# EAGLE design Aquarius (EAGLE 6.4)
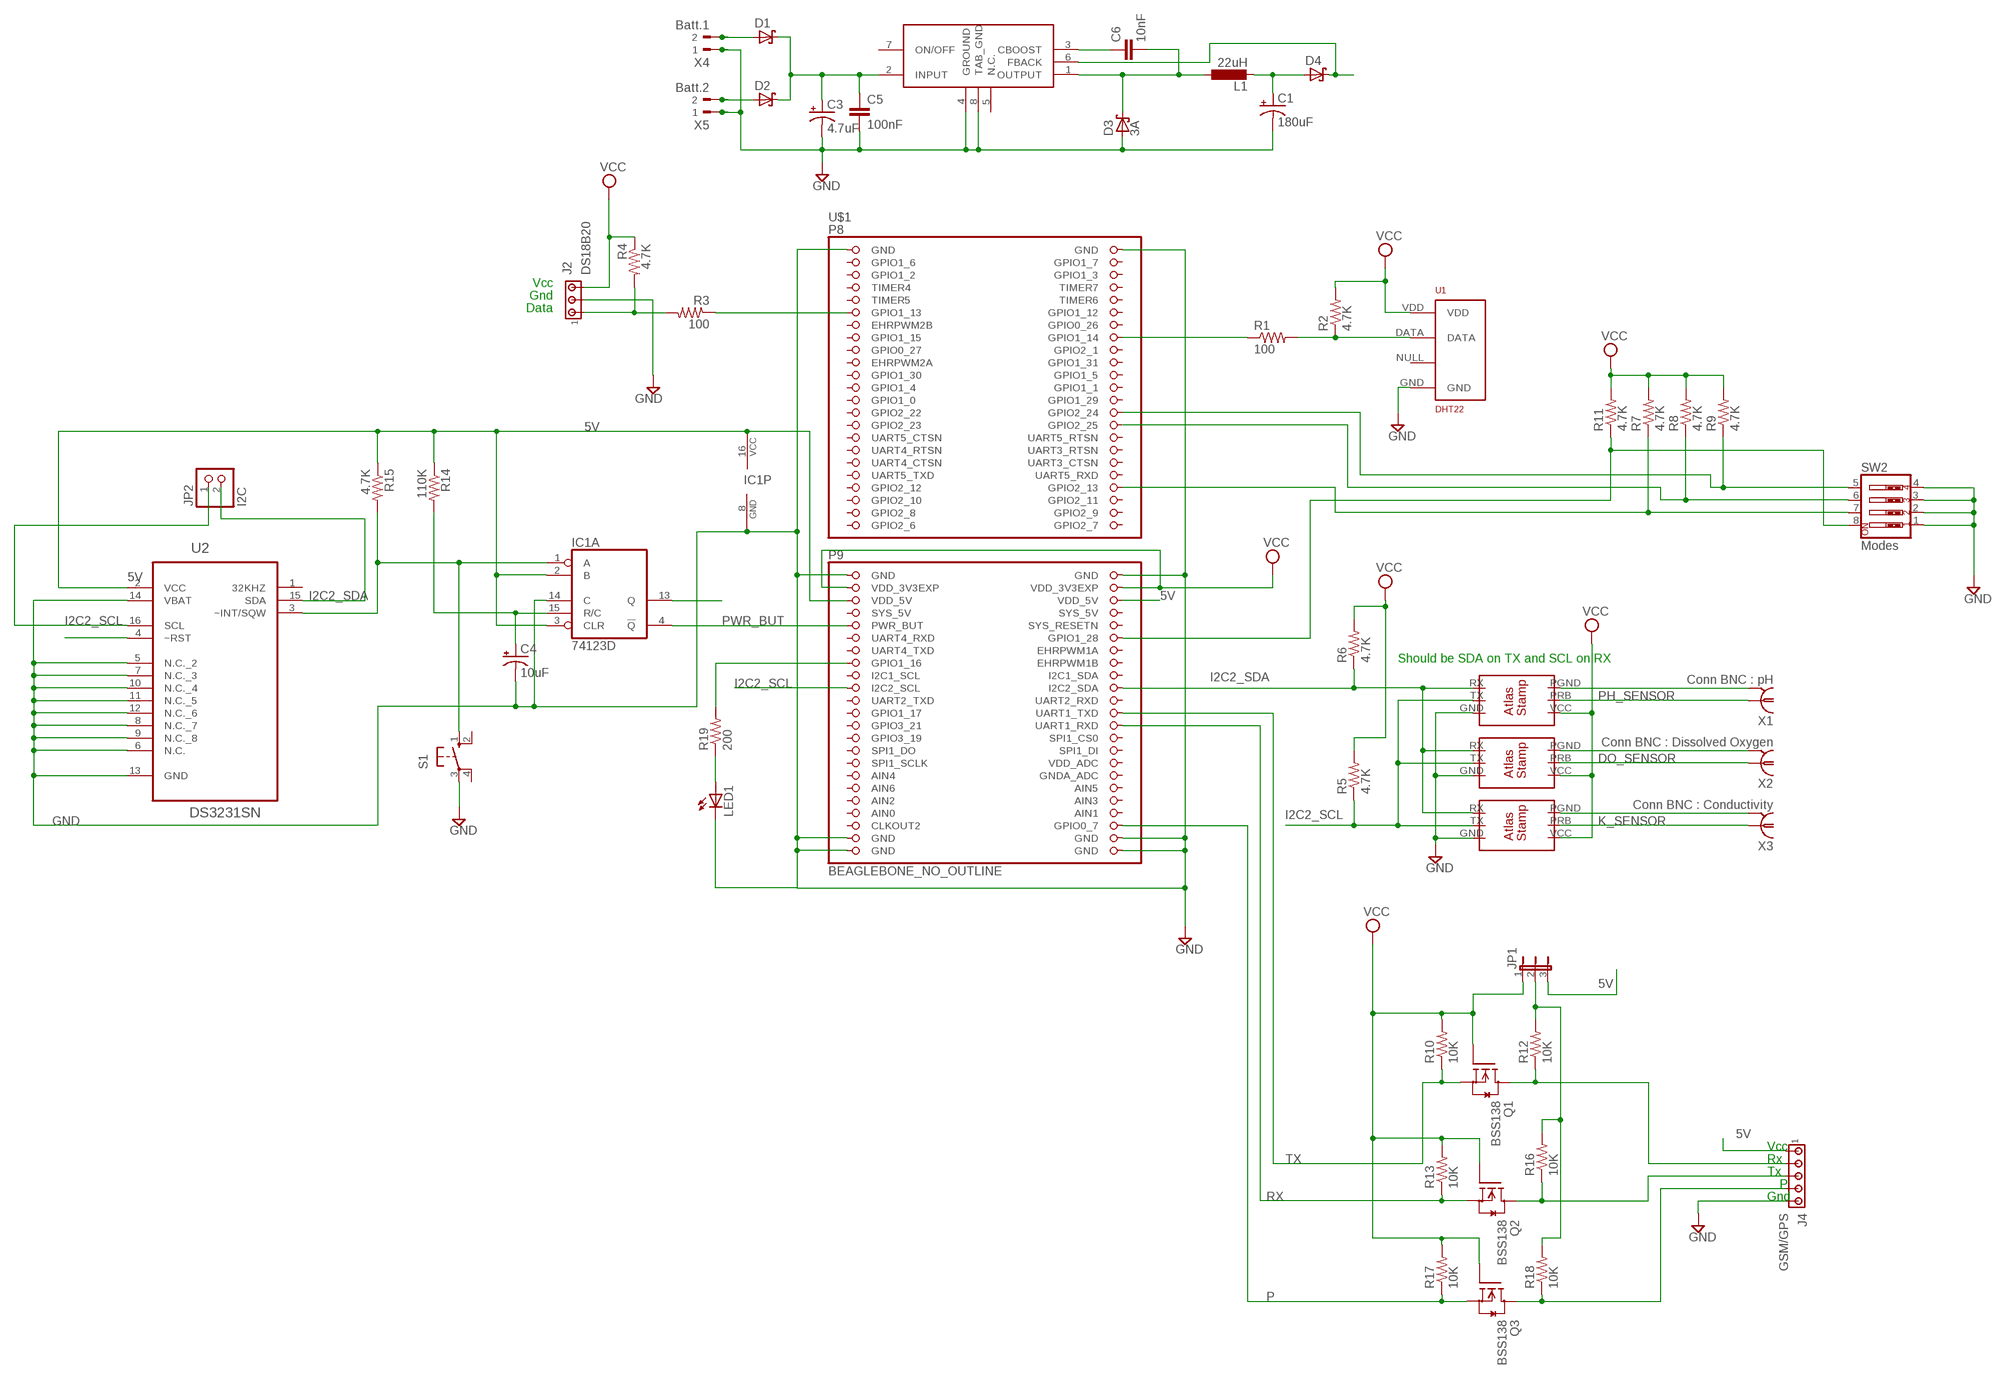
[diagram p0: schematic, sheet 1]

## Parts
C1  180uF  CPOL-USD  [PANASONIC_D]
C3  4.7uF  CPOL-USB  [PANASONIC_B]
C4  10uF  CPOL-USB  [PANASONIC_B]
C5  100nF  C-EUC0805  [C0805]
C6  10nF  C-EUC0805  [C0805]
D1  SCHOTTKY-DIODEDO201T15  [DO201T15]
D2  SCHOTTKY-DIODEDO201T15  [DO201T15]
D3  3A  SCHOTTKY-DIODEDO201T15  [DO201T15]
D4  SCHOTTKY-DIODEDO201T15  [DO201T15]
IC1  74123D  [SO16]
J2  DS18B20  MTA03-100  [10X03MTA]
J4  GSM/GPS  MTA05-100  [10X05MTA]
JP1  JP2E  [JP2]
JP2  I2C  PINHD-1X2  [1X02]
L1  22uH  L-EU10X10-EPCOS  [EPCOS-10X10]
LED1  LEDCHIP-LED0805  [CHIP-LED0805]
LM2678  LM2678KTW0007B  [TO-PMOD7]
Q1  BSS138  [SOT23]
Q2  BSS138  [SOT23]
Q3  BSS138  [SOT23]
R1  100  R-US_R0805  [R0805]
R2  4.7K  R-US_R0805  [R0805]
R3  100  R-US_R0805  [R0805]
R4  4.7K  R-US_R0805  [R0805]
R5  4.7K  R-US_R0805  [R0805]
R6  4.7K  R-US_R0805  [R0805]
R7  4.7K  R-US_R0805  [R0805]
R8  4.7K  R-US_R0805  [R0805]
R9  4.7K  R-US_R0805  [R0805]
R10  10K  R-US_R0805  [R0805]
R11  4.7K  R-US_R0805  [R0805]
R12  10K  R-US_R0805  [R0805]
R13  10K  R-US_R0805  [R0805]
R14  110K  R-US_R0805  [R0805]
R15  4.7K  R-US_R0805  [R0805]
R16  10K  R-US_R0805  [R0805]
R17  10K  R-US_R0805  [R0805]
R18  10K  R-US_R0805  [R0805]
R19  200  R-US_R0805  [R0805]
S1  10-XX  [B3F-10XX]
SW2  Modes  SW_DIP-4  [EDG-04]
U1  DHT22  RHT03_DHT-22_AM2302WIRED  [AM2302]
U2  DS3231SN  [SOIC127P1032X265-16N]
U$1  BEAGLEBONE_NO_OUTLINE  [BEAGLEBONE_SHIELD_NO_OUTLINE]
U$2  ATLAS_STAMP  [ATLAS_STAMP]
U$3  ATLAS_STAMP  [ATLAS_STAMP]
U$4  ATLAS_STAMP  [ATLAS_STAMP]
X1  Conn BNC : pH  1-227161-0  [AMP_227161]
X2  Conn BNC : Dissolved Oxygen  1-227161-0  [AMP_227161]
X3  Conn BNC : Conductivity  1-227161-0  [AMP_227161]
X4  Batt.1  180G-2  [180G-2]
X5  Batt.2  180G-2  [180G-2]

## Nets
5V: D4.C IC1.2(A:B) IC1.3(A:CLR) IC1.16(P:VCC) J4.1 JP1.3 LM2678.6(FBACK) R14.1 R15.1 U2.2(VCC) U$1.51(VDD_5V) U$1.52(VDD_5V)
DO_SENSOR: U$3.PRB X2.1
GND: C1.- C3.- C4.- C5.2 D3.A IC1.8(P:GND) IC1.14(A:C) J2.2 J4.5 LED1.C LM2678.4(GROUND) LM2678.8(TAB_GND) S1.3(P) SW2.1 SW2.2 SW2.3 SW2.4 U1.GND U2.5(N.C._2) U2.6(N.C.) U2.7(N.C._3) U2.8(N.C._7) U2.9(N.C._8) U2.10(N.C._4) U2.11(N.C._5) U2.12(N.C._6) U2.13(GND) U2.14(VBAT) U$1.1(GND) U$1.2(GND) U$1.47(GND) U$1.48(GND) U$1.89(GND) U$1.90(GND) U$1.91(GND) U$1.92(GND) U$2.GND U$3.GND U$4.GND X4.1 X5.1
I2C2_SCL: JP2.1 R5.1 U2.16(SCL) U$1.65(I2C2_SCL) U$2.TX U$3.TX U$4.TX
I2C2_SDA: JP2.2 R6.1 U2.15(SDA) U$1.66(I2C2_SDA) U$2.RX U$3.RX U$4.RX
INT: IC1.1(A:A) R15.2 S1.1(S) U2.3(~INT/SQW)
K_SENSOR: U$4.PRB X3.1
N$1: J4.4 Q3.3(D) R18.1
N$2: D1.A X4.2
N$3: R1.2 R2.1 U1.DATA
N$4: R3.1 U$1.11(GPIO1_13)
N$5: J2.1 R3.2 R4.2
N$6: R1.1 U$1.16(GPIO1_14)
N$7: R7.1 SW2.7 U$1.40(GPIO2_13)
N$8: D2.A X5.2
N$9: C6.1 LM2678.3(CBOOST)
N$10: C3.+ C5.1 D1.C D2.C LM2678.2(INPUT)
N$11: U$2.PGND X1.2
N$12: U2.4(~RST)
N$13: C6.2 D3.C L1.P$1 LM2678.1(OUTPUT)
N$14: U$4.PGND X3.2
N$15: U$3.PGND X2.2
N$16: C1.+ D4.A L1.P$2
N$17: C4.+ IC1.15(A:R/C) R14.2
N$18: R11.1 SW2.8 U$1.58(GPIO1_28)
N$19: R8.1 SW2.6 U$1.30(GPIO2_25)
N$20: IC1.13(A:Q)
N$21: R9.1 SW2.5 U$1.28(GPIO2_24)
N$22: J4.3 Q2.3(D) R16.1
N$23: J4.2 Q1.3(D) R12.1
N$25: JP1.2 R12.2 R16.2 R18.2
N$26: LED1.A R19.1
N$27: R19.2 U$1.61(GPIO1_16)
P: Q3.2(S) R17.1 U$1.88(GPIO0_7)
PH_SENSOR: U$2.PRB X1.1
PWR_BUT: IC1.4(A:!Q) U$1.55(PWR_BUT)
RX: Q2.2(S) R13.1 U$1.72(UART1_RXD)
TX: Q1.2(S) R10.1 U$1.70(UART1_TXD)
VCC: J2.3 JP1.1 Q1.1(G) Q2.1(G) Q3.1(G) R2.2 R4.1 R5.2 R6.2 R7.2 R8.2 R9.2 R10.2 R11.2 R13.2 R17.2 U1.VDD U$1.49(VDD_3V3EXP) U$1.50(VDD_3V3EXP) U$2.VCC U$3.VCC U$4.VCC
Unconnected: IC1.5(B:Q) IC1.6(B:C) IC1.7(B:R/C) IC1.9(B:A) IC1.10(B:B) IC1.11(B:CLR) IC1.12(B:!Q) LM2678.5(N.C.) LM2678.7(ON/OFF) S1.2(S1) S1.4(P1) U1.NULL U2.1(32KHZ) U$1.3(GPIO1_6) U$1.4(GPIO1_7) U$1.5(GPIO1_2) U$1.6(GPIO1_3) U$1.7(TIMER4) U$1.8(TIMER7) U$1.9(TIMER5) U$1.10(TIMER6) U$1.12(GPIO1_12) U$1.13(EHRPWM2B) U$1.14(GPIO0_26) U$1.15(GPIO1_15) U$1.17(GPIO0_27) U$1.18(GPIO2_1) U$1.19(EHRPWM2A) U$1.20(GPIO1_31) U$1.21(GPIO1_30) U$1.22(GPIO1_5) U$1.23(GPIO1_4) U$1.24(GPIO1_1) U$1.25(GPIO1_0) U$1.26(GPIO1_29) U$1.27(GPIO2_22) U$1.29(GPIO2_23) U$1.31(UART5_CTSN) U$1.32(UART5_RTSN) U$1.33(UART4_RTSN) U$1.34(UART3_RTSN) U$1.35(UART4_CTSN) U$1.36(UART3_CTSN) U$1.37(UART5_TXD) U$1.38(UART5_RXD) U$1.39(GPIO2_12) U$1.41(GPIO2_10) U$1.42(GPIO2_11) U$1.43(GPIO2_8) U$1.44(GPIO2_9) U$1.45(GPIO2_6) U$1.46(GPIO2_7) U$1.54(SYS_5V) U$1.56(SYS_RESETN) U$1.57(UART4_RXD) U$1.59(UART4_TXD) U$1.60(EHRPWM1A) U$1.62(EHRPWM1B) U$1.63(I2C1_SCL) U$1.64(I2C1_SDA) U$1.67(UART2_TXD) U$1.68(UART2_RXD) U$1.69(GPIO1_17) U$1.71(GPIO3_21) U$1.73(GPIO3_19) U$1.74(SPI1_CS0) U$1.75(SPI1_DO) U$1.76(SPI1_DI) U$1.77(SPI1_SCLK) U$1.78(VDD_ADC) U$1.79(AIN4) U$1.80(GNDA_ADC) U$1.81(AIN6) U$1.82(AIN5) U$1.83(AIN2) U$1.84(AIN3) U$1.86(AIN1) U$1.87(CLKOUT2)

## Notes on the sheet
- Vcc
- Gnd
- Data
- Should be SDA on TX and SCL on RX
- Vcc
- Rx
- Tx
- P
- Gnd

## Power pins joined to a net without a drawn wire
AIN0: U$1.85(AIN0)
SYS_5V: U$1.53(SYS_5V)

## Library data of the parts
C1 C3 C4 = rcl:CPOL-US: POLARIZED CAPACITOR, American symbol
C5 C6 = rcl:C-EU: CAPACITOR, European symbol
D1-D4 = diode:SCHOTTKY-DIODE: Schottky Diode
IC1 = 74xx-us:74*123: Retriggerable monostable MULTIVIBRATOR
J2 = con-amp:MTA03-100: AMP connector
J4 = con-amp:MTA05-100: AMP connector
JP1 = jumper:JP2E: JUMPER
JP2 = pinhead:PINHD-1X2: PIN HEADER
L1 = jt-inductors:L-EU: Inductor
LED1 = led:LED: LED OSRAM: - CHIPLED LG R971, LG N971, LY N971, LG Q971, LY Q971, LO R971, LY R971 LH N974, LH R974 LS Q976, LO Q976, LY Q976 LO Q996 - Hyper CHIPLED LW Q18S LB Q993, LB Q99A, LB R99A - SideLED LS A670, LO A670, LY A670, LG A670, LP A670 LB A673, LV A673, LT A673, LW A673 LH A674 LY A675 LS A676, LA A676, LO A676, LY A676, LW A676 LS A679, LY A679, LG A679 - Hyper Micro SIDELED® LS Y876, LA Y876, LO Y876, LY Y876 LT Y87S - SmartLED LW L88C, LW L88S LB L89C, LB L89S, LG L890 LS L89K, LO L89K, LY L89K LS L896, LA L896, LO L896, LY L896 - TOPLED LS T670, LO T670, LY T670, LG T670, LP T670 LSG T670, LSP T670, LSY T670, LOP T670, LYG T670 LG T671, LOG T671, LSG T671 LB T673, LV T673, LT T673, LW T673 LH T674 LS T676, LA T676, LO T676, LY T676, LB T676, LH T676, LSB T676, LW T676 LB T67C, LV T67C, LT T67C, LS T67K, LO T67K, LY T67K, LW E67C LS E67B, LA E67B, LO E67B, LY E67B, LB E67C, LV E67C, LT E67C LW T67C LS T679, LY T679, LG T679 LS T770, LO T770, LY T770, LG T770, LP T770 LB T773, LV T773, LT T773, LW T773 LH T774 LS E675, LA E675, LY E675, LS T675 LS T776, LA T776, LO T776, LY T776, LB T776 LHGB T686 LT T68C, LB T68C - Hyper Mini TOPLED® LB M676 - Mini TOPLED Santana® LG M470 LS M47K, LO M47K, LY M47K Source: http://www.osram.convergy.de LUXEON: - LUMILED® LXK2-PW12-R00, LXK2-PW12-S00, LXK2-PW14-U00, LXK2-PW14-V00 LXK2-PM12-R00, LXK2-PM12-S00, LXK2-PM14-U00 LXK2-PE12-Q00, LXK2-PE12-R00, LXK2-PE12-S00, LXK2-PE14-T00, LXK2-PE14-U00 LXK2-PB12-K00, LXK2-PB12-L00, LXK2-PB12-M00, LXK2-PB14-N00, LXK2-PB14-P00, LXK2-PB14-Q00 LXK2-PR12-L00, LXK2-PR12-M00, LXK2-PR14-Q00, LXK2-PR14-R00 LXK2-PD12-Q00, LXK2-PD12-R00, LXK2-PD12-S00 LXK2-PH12-R00, LXK2-PH12-S00 LXK2-PL12-P00, LXK2-PL12-Q00, LXK2-PL12-R00 Source: www.luxeon.com KINGBRIGHT: KA-3528ASYC Source: www.kingbright.com
LM2678 = Aquarius:LM2678: LM2678 SIMPLE SWITCHER® High Efficiency 5A Step-Down Voltage Regulator
Q1-Q3 = m-pad-2.1:BSS138: Fairchild Semiconductors BSS138 N-Channel Logic Level Enhancement Mode Field Effect Transistor General Description: These N-Channel enhancement mode field effect transistors are produced using Fairchild's proprietary, high cell density, DMOS technology. These products have been designed to minimize on-state resistance while provide rugged, reliable, and fast switching performance.These products are particularly suited for low voltage, low current applications such as small servo motor control, power MOSFET gate drivers, and other switching applications. Features: 0.22 A, 50 V. RDS(ON) = 3.5Ohm @ VGS = 10 V RDS(ON) = 6.0Ohm @ VGS = 4.5 V High density cell design for extremely low RDS(ON) Rugged and Reliable Compact industry standard SOT-23 surface mount package Please send any comments to: messi@users.sourceforge.net
R1-R19 = adafruit:R-US_: RESISTOR, American symbol
S1 = switch-omron:10-XX: OMRON SWITCH; MPN: B3F-1000; OC_FARNELL: 176432; OC_NEWARK: 36M3542
SW2 = special:SW_DIP-4: DIP SWITCH
U1 = RHT03_DHT-22_AM2302:RHT03_DHT-22_AM2302: RHT03 / DHT-22 / AM2302 Packages and symbol for the RHT03 / DHT-22 relative humidity and temperature sensor. Note: The AM2302 is a wired version of the DHT-22 which typically requires less clearance and is thus provided as a separate package.; PROD_ID: SEN-10167
U2 = Maxim_By_element14_Batch_1:DS3231SN: Extremely Accurate I2C-Integrated RTC/TCXO/Crystal; MPN: DS3231SN#; OC_FARNELL: 1593292; OC_NEWARK: 68K3406; PACKAGE: SOIC-16; SUPPLIER: Maxim
U$1 = LEDscape:BEAGLEBONE_NO_OUTLINE: Should match A3 pinout - but not completely tested
U$2-U$4 = LEDscape:ATLAS_STAMP
X1-X3 = con-coax:?227161*: JACK, RIGHT ANGLE, 50 OHM, PCB, BNC Source: amp_227161.pdf; MF: TYCO ELECTRONICS; MPN: 1-227161; OC_FARNELL: unknown; OC_NEWARK: 33B3200
X4 X5 = con-weidmueller-sl35:180G-2: WEIDMUELLER CLAMP CONNECTOR; OC_FARNELL: unknown; OC_NEWARK: unknown

## Board
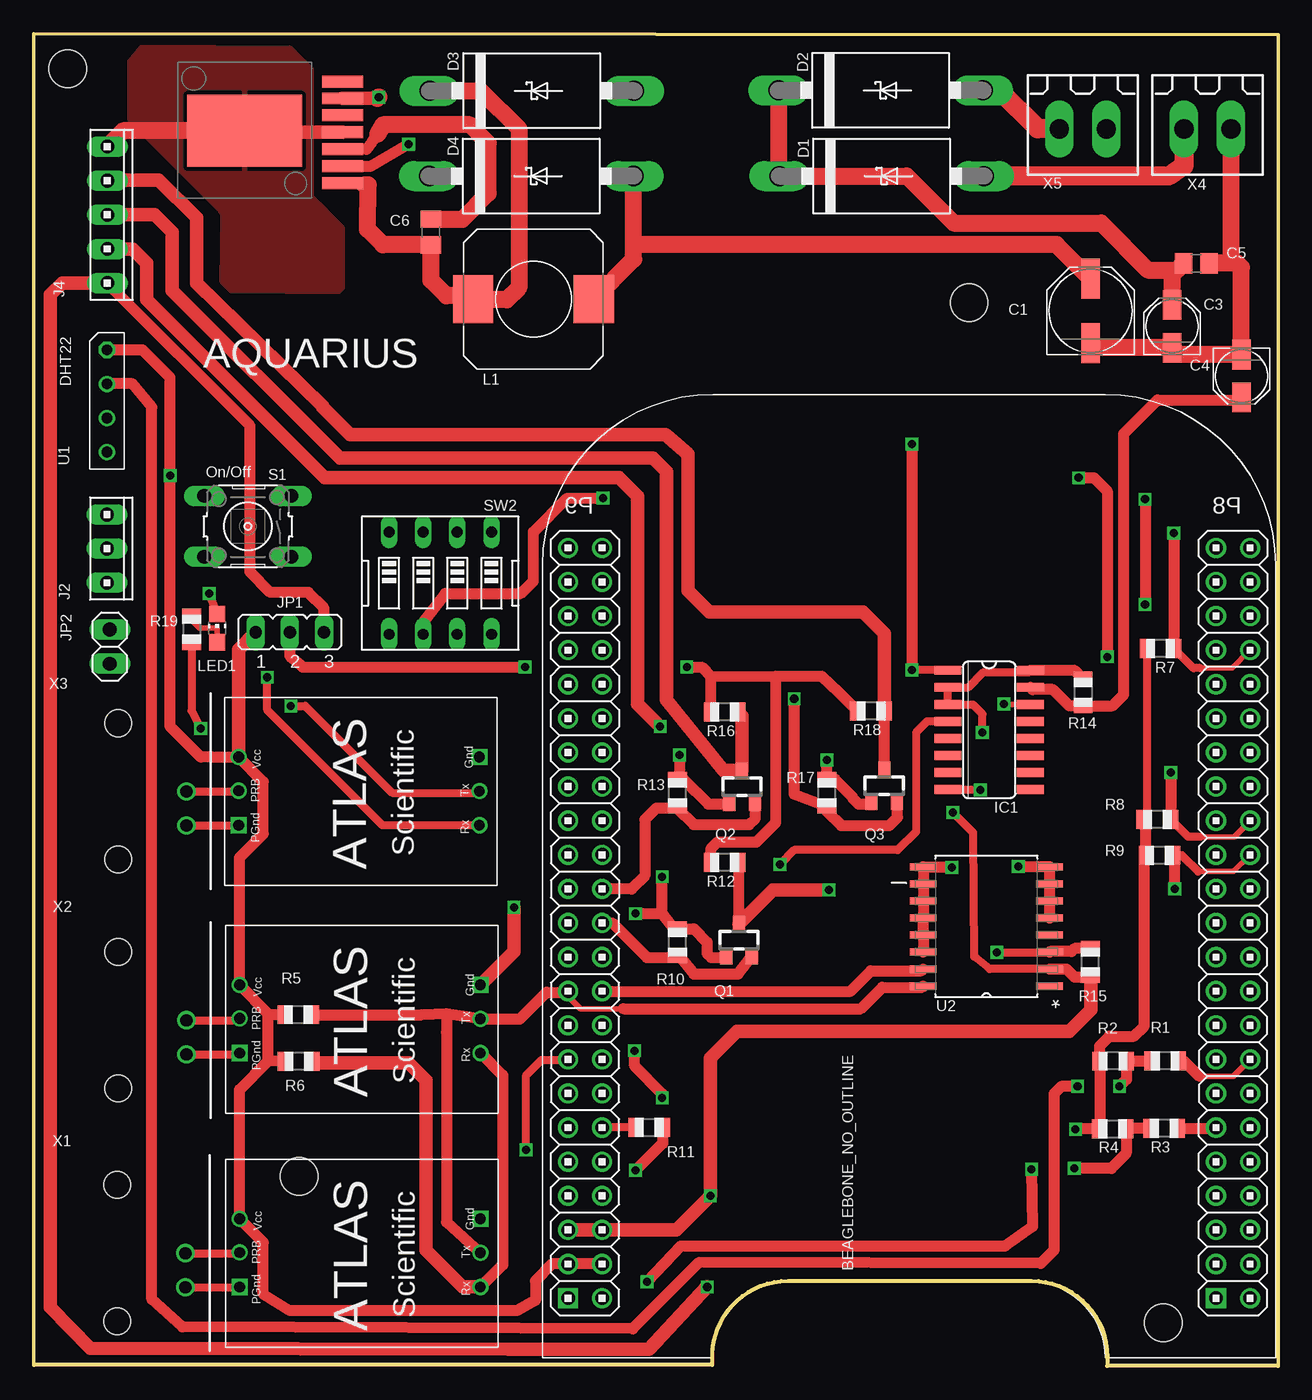
[diagram p1: board, top side]
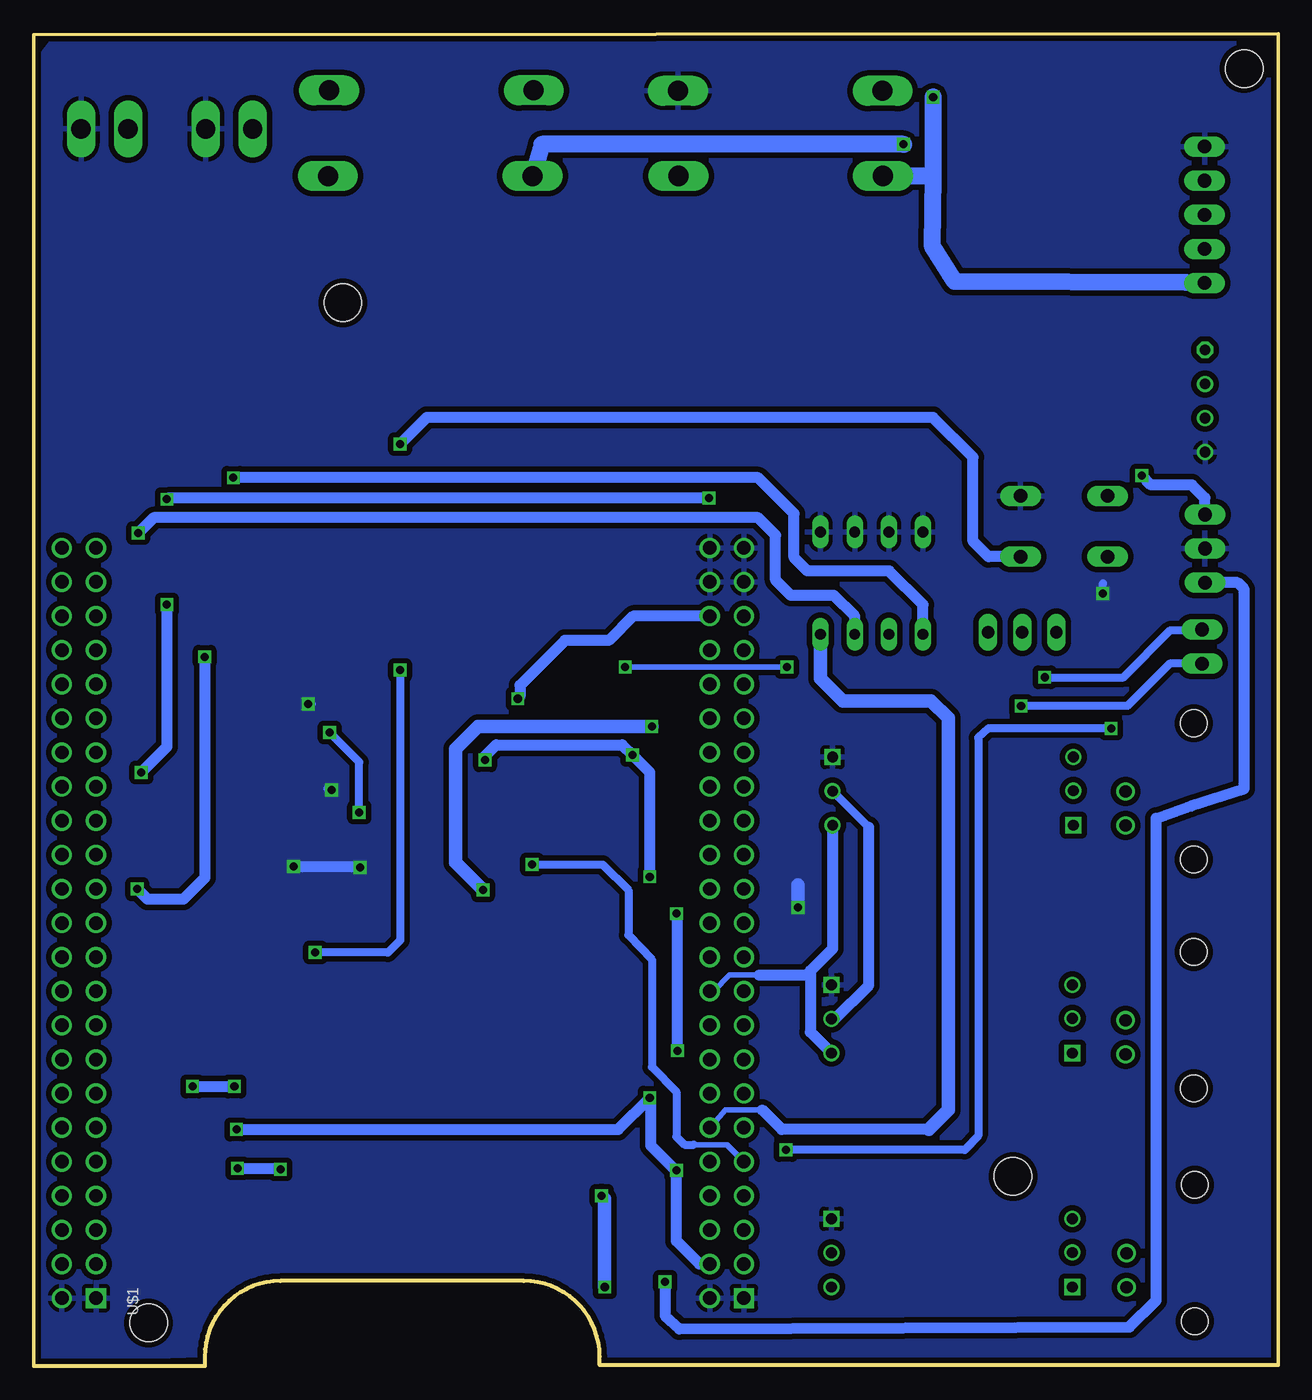
[diagram p2: board, bottom side, seen from below]

Size 92.72 x 99.24 mm. Coordinates in mm from the lower left corner, seen from the top.
Outline: 92.72,0 92.72,99.16 0,99.24 0,0.08
Outline: 92.7,0.01 79.97,0.01 79.97,0.7 arc90 74.33,6.33 56.2,6.33 arc90 50.56,0.7 50.56,0.09 0.04,0.09
Copper layers (1*16): Top 0.0356mm / dielectric 1.5011mm / Bottom 0.0356mm
Design rules "LaenPCBOrder *": minimum track width 6mil, minimum drill 13mil, track to track 10mil, track to pad 6mil, pad to pad 6mil, via to via 6mil, smd to smd 6mil, copper to edge 15mil, drill to drill 6mil, minimum pad ring 7mil, minimum via ring 7mil, stop-mask expansion 3mil, vias tented up to drill 0mil, thermal gap 12mil
Holes 2.8 mm at 84.16,3.21 69.68,79.18 2.55,96.63 19.77,14.11

### Footprints (pad centres in the part's own frame; a part is rotated, then mirrored left to right if it is on the bottom)
PANASONIC_D = smd 3 x 1.4: + 2.4,0; - -2.4,0
PANASONIC_B = smd 2.2 x 1.4: + 1.6,0; - -1.6,0
C0805 = smd 1.3 x 1.5: 1 -0.95,0; 2 0.95,0
DO201T15 = drill 1.499 long: A 7.62,0; C -7.62,0
SO16 = smd 0.66 x 2.032: 1 -4.445,-3.073; 2 -3.175,-3.073; 3 -1.905,-3.073; 4 -0.635,-3.073; 5 0.635,-3.073; 6 1.905,-3.073; 7 3.175,-3.073; 8 4.445,-3.073; 9 4.445,3.073; 10 3.175,3.073; 11 1.905,3.073; 12 0.635,3.073; 13 -0.635,3.073; 14 -1.905,3.073; 15 -3.175,3.073; 16 -4.445,3.073
10X03MTA = drill 1.016 long: 1 2.54,0; 2 0,0; 3 -2.54,0
10X05MTA = drill 1.016 long: 1 5.08,0; 2 2.54,0; 3 0,0; 4 -2.54,0; 5 -5.08,0
JP2 = drill 0.914 long: 1 -2.54,0; 2 0,0; 3 2.54,0
1X02 = drill 1.016 long: 1 -1.27,0; 2 1.27,0
EPCOS-10X10 = smd 3 x 3.6: P$1 -4.5,0; P$2 4.5,0
CHIP-LED0805 = smd 1.2 x 1.2: A 0,-1.05; C 0,1.05
TO-PMOD7 = smd 0.89 x 3.06: 1 -3.88,-7.3; 2 -2.62,-7.3; 3 -1.36,-7.3; 4 -0.1,-7.3; 5 1.16,-7.3; 6 2.42,-7.3; 7 3.68,-7.3 | smd 5.35 x 8.54: 8 0.01,0
SOT23 = smd 0.9 x 1.2: 1 -0.95,-1.2; 2 0.95,-1.2; 3 0,1.2
R0805 = smd 1.1 x 1.4: 1 -1,0; 2 1,0
B3F-10XX = drill 1.016 long: 1 -3.251,2.261; 2 3.251,2.261; 3 -3.251,-2.261; 4 3.251,-2.261
EDG-04 = drill 0.813 long: 1 -3.81,-3.81; 2 -1.27,-3.81; 3 1.27,-3.81; 4 3.81,-3.81; 5 3.81,3.81; 6 1.27,3.81; 7 -1.27,3.81; 8 -3.81,3.81
AM2302 = drill 0.8: DATA -1.27,0; GND 3.81,0; NULL 1.27,0 | drill 0.8 octagon: VDD -3.81,0
SOIC127P1032X265-16N = smd 1.981 x 0.533: 1 -4.699,4.445; 2 -4.699,3.175; 3 -4.699,1.905; 4 -4.699,0.635; 5 -4.699,-0.635; 6 -4.699,-1.905; 7 -4.699,-3.175; 8 -4.699,-4.445; 9 4.699,-4.445; 10 4.699,-3.175; 11 4.699,-1.905; 12 4.699,-0.635; 13 4.699,0.635; 14 4.699,1.905; 15 4.699,3.175; 16 4.699,4.445
BEAGLEBONE_SHIELD_NO_OUTLINE = drill 1 square: 1 4.445,19.05; 47 52.705,19.05 | drill 1: 2 1.905,19.05; 3 4.445,21.59; 4 1.905,21.59; 5 4.445,24.13; 6 1.905,24.13; 7 4.445,26.67; 8 1.905,26.67; 9 4.445,29.21; 10 1.905,29.21; 11 4.445,31.75; 12 1.905,31.75; 13 4.445,34.29; 14 1.905,34.29; 15 4.445,36.83; 16 1.905,36.83; 17 4.445,39.37; 18 1.905,39.37; 19 4.445,41.91; 20 1.905,41.91; 21 4.445,44.45; 22 1.905,44.45; 23 4.445,46.99; 24 1.905,46.99; 25 4.445,49.53; 26 1.905,49.53; 27 4.445,52.07; 28 1.905,52.07; 29 4.445,54.61; 30 1.905,54.61; 31 4.445,57.15; 32 1.905,57.15; 33 4.445,59.69; 34 1.905,59.69; 35 4.445,62.23; 36 1.905,62.23; 37 4.445,64.77; 38 1.905,64.77; 39 4.445,67.31; 40 1.905,67.31; 41 4.445,69.85; 42 1.905,69.85; 43 4.445,72.39; 44 1.905,72.39; 45 4.445,74.93; 46 1.905,74.93; 48 50.165,19.05; 49 52.705,21.59; 50 50.165,21.59; 51 52.705,24.13; 52 50.165,24.13; 53 52.705,26.67; 54 50.165,26.67; 55 52.705,29.21; 56 50.165,29.21; 57 52.705,31.75; 58 50.165,31.75; 59 52.705,34.29; 60 50.165,34.29; 61 52.705,36.83; 62 50.165,36.83; 63 52.705,39.37; 64 50.165,39.37; 65 52.705,41.91; 66 50.165,41.91; 67 52.705,44.45; 68 50.165,44.45; 69 52.705,46.99; 70 50.165,46.99; 71 52.705,49.53; 72 50.165,49.53; 73 52.705,52.07; 74 50.165,52.07; 75 52.705,54.61; 76 50.165,54.61; 77 52.705,57.15; 78 50.165,57.15; 79 52.705,59.69; 80 50.165,59.69; 81 52.705,62.23; 82 50.165,62.23; 83 52.705,64.77; 84 50.165,64.77; 85 52.705,67.31; 86 50.165,67.31; 87 52.705,69.85; 88 50.165,69.85; 89 52.705,72.39; 90 50.165,72.39; 91 52.705,74.93; 92 50.165,74.93
ATLAS_STAMP = drill 0.8 square: GND 4.445,18.97; PGND 9.525,1.03 | drill 0.8: PRB 6.95,1.03; RX 9.525,18.97; TX 6.985,18.97; VCC 4.445,1.03
AMP_227161 = drill 0.9 pad 1.27: 1 0,-5.08; 2 -2.54,-5.08 | hole 2: -5.08,0; 5.08,0
180G-2 = drill 1.422 long: 1 -1.75,0; 2 1.75,0

### Placement (x,y rotation side)
C1  78.73,78.59 90 top
C3  84.81,77.44 90 top
C4  89.97,73.73 270 top
C5  86.59,82.12 0 top
C6  29.59,84.46 270 top
D1  63.17,88.63 0 top
D2  63.09,95.01 0 top
D3  37.11,94.98 0 top
D4  37.07,88.63 0 top
DRILEGEND  [DRILEGEND]  -22.35,-18.83 0 top  (outside the outline)
IC1  71.17,47.37 270 top
J2  5.47,60.88 270 top
J4  5.49,85.74 270 top
JP1  19.09,54.65 0 top
JP2  5.68,53.58 90 top
L1  37.23,79.46 0 top
LED1  13.68,54.95 0 top
LM2678  15.72,91.99 90 top
Q1  52.54,31.71 0 top
Q2  52.77,43.14 0 top
Q3  63.36,43.22 0 top
R1  84.29,22.72 180 top
R2  80.4,22.71 180 top
R3  84.21,17.7 180 top
R4  80.38,17.67 0 top
R5  19.72,26.16 180 top
R6  19.74,22.69 180 top
R7  83.93,53.43 180 top
R8  83.71,40.7 180 top
R9  83.86,38.03 180 top
R10  47.97,31.56 90 top
R11  45.86,17.78 0 top
R12  51.47,37.5 180 top
R13  47.97,42.68 90 top
R14  78.17,50.17 270 top
R15  78.72,30.09 90 top
R16  51.47,48.7 180 top
R17  59.09,42.68 90 top
R18  62.37,48.78 180 top
R19  11.77,54.87 270 top
S1  15.96,62.54 180 top
SW2  30.29,58.3 180 top
U1  5.46,71.87 270 top
U2  70.97,32.73 180 top
U$1  92.52,-14 0 bottom
U$2  14.31,15.4 270 top
U$3  14.31,32.83 270 top
U$4  14.24,49.8 270 top
X1  6.23,8.4 90 top
X2  6.3,25.75 90 top
X3  6.3,42.8 90 top
X4  87.44,92.14 180 top
X5  78.14,92.14 180 top

### Tracks (layer width: path | path; a pad name or v marks a point on that pad's centre or on a via)
5V  (via drill 0.6)
  Top 0.61: v68.47,41.23 69.99,39.71 70.07,30.49 71.22,29.56 U2.2 | v70.68,47.18 70.68,48.55 69.99,49.24 68.14,49.24 IC1.3 IC1.2 69.63,50.55 70.75,51.67 74.1,51.67 IC1.16
  Top 0.813: U2.2 76.94,29.56 77.53,28.97 78.6,28.97 R15.1 | IC1.16 77.52,51.82 R14.1 | JP1.3 21.63,56.45 20.46,57.62 17.64,57.62 16.12,59.14 16.12,70.04 J4.1
  Top 1.016: U$1.51 U$1.52 47.88,10.13 v50.41,12.66 50.41,22.95 52.39,24.93 77.15,24.93 78.75,26.53 78.75,29.06 R15.1 | J4.1 2.12,80.66 1.26,79.79 1.26,4.35 4.23,1.31 35.39,1.23 45.83,1.23 v50.18,5.88 | LM2678.6 25.62,94.41
  Top 1.27: 25.62,94.41 v25.72,94.5
  Bottom 0.61: v68.47,41.23 68.47,44.97 v70.68,47.18
  Bottom 1.016: v50.18,5.88 50.18,12.43 v50.41,12.66
  Bottom 1.27: v25.72,94.5 25.72,88.63 | 25.72,88.63 D4.C | 25.72,88.63 25.79,83.45 24.12,80.78 6.89,80.71 J4.1
DO_SENSOR
  Top 0.61: X2.1 15.34,25.75 U$3.PRB
GND  (via drill 0.6)
  Top 0.406: IC1.14 72.31,49.28 v72.28,49.31
  Top 0.61: IC1.8 69.82,42.93 v70.52,42.91 | LED1.C v13.07,57.54
  Top 0.813: U2.14 U2.13 U2.12 U2.11 U2.10 U2.9 66.33,37.12 v68.39,37.12 | U2.5 U2.6 U2.7 U2.8 73.36,37.18 v73.34,37.2
  Top 1.016: 87.57,82.15 C5.2 | 89.19,82.3 89.04,82.15 | LM2678.4 15.83,91.88 | U$3.GND 35.78,30.87 v35.78,34.15
  Top 1.27: 87.57,82.15 89.04,82.15 89.65,82.15 89.97,81.84 C4.- 85.32,75.33 C3.- 79.07,75.84 C1.- | X4.1 89.19,82.3 | 15.83,91.88 LM2678.8 6.67,92 J4.5
  Bottom 0.406: v72.28,49.31 71.89,49.31
  Bottom 0.61: v70.52,42.91 70.75,42.91 70.83,42.99 | v13.07,57.54 13.07,58.3
  Bottom 0.813: v73.34,37.2 68.47,37.2 v68.39,37.12
  Bottom 1.016: v35.78,34.15 35.78,35.83
  pour Bottom (isolate 0.406): 80.28,0.85 89.27,0.54 92.01,0.54 92.01,97.78 91.1,98.92 1.18,98.99 0.34,98.16 0.34,1.15 0.8,0.7 50.1,0.85 arc-90 55.59,6.64 74.64,6.72 arc-90
  pour Top (isolate 0.406): 20.69,96.56 20.69,87.11 21.75,86.04 21.75,85.96 22.97,84.75 22.97,80.33 22.67,80.02 14.74,80.1 14.06,80.78 14.13,85.66 13.83,86.19 7.2,92.82 7.2,97.17 8.04,98.23 19.09,98.16
I2C2_SCL  (via drill 0.6)
  Top 0.406: U$1.65 39.81,27.52 40.73,26.61 43.93,26.61
  Top 0.61: v19.16,49.16 20.23,49.16 26.71,42.68 33.08,42.68 U$4.TX
  Top 0.813: R5.1 28.9,26.16 30.75,26.22 | 30.75,26.22 30.75,24.85 30.75,10.73 U$2.TX | 30.75,26.22 U$3.TX 36.23,25.84 38.21,27.82 39.73,27.82 U$1.65 | 43.93,26.61 61.61,26.61 63.21,28.2 66.19,28.2 U2.16
  Bottom 0.61: 30.52,40.12 30.55,40.12 30.55,40.15 U$4.TX | JP2.1 8.09,52.31 11.24,49.16 v19.16,49.16
  Bottom 0.813: U$3.TX 33.03,25.84 30.52,28.36 30.52,40.12
I2C2_SDA  (via drill 0.6)
  Top 0.61: U$4.RX 26,40.27 17.41,48.86 v17.41,51.29
  Top 0.813: U$1.66 60.86,27.91 62.37,29.42 66.14,29.42 U2.15 | U$3.RX 34.94,21.65 34.94,7.53 U$2.RX
  Top 1.016: R6.1 20.87,22.57 27.93,22.57 29.22,21.27 29.22,8.62 31.96,5.88 U$2.RX
  Bottom 0.406: U$1.66 42.09,27.91 40.88,29.12 38.67,29.12
  Bottom 0.61: v17.41,51.29 11.54,51.29 8.04,54.8 5.96,54.8 JP2.2
  Bottom 0.813: U$4.RX 33.21,31.08 34.86,29.42 34.86,29.27 | 34.86,29.27 34.86,24.88 U$3.RX | 38.67,29.12 35.01,29.12 34.86,29.27
INT  (via drill 0.6)
  Top 0.61: IC1.1 v65.43,51.82 v65.42,51.83 | v71.74,30.8 75.64,30.8 U2.3
  Top 0.813: R15.2 77.52,31.09 77.3,30.87 75.72,30.87 U2.3 | v65.42,68.67 v65.42,51.83
  Bottom 0.61: v65.42,51.83 65.42,31.71 66.33,30.8 v71.74,30.8
  Bottom 0.813: S1.1 21.59,60.27 22.75,61.43 22.75,67.68 25.72,70.65 63.44,70.65 v65.42,68.67
K_SENSOR
  Top 0.61: X3.1 15.27,42.8 U$4.PRB
N$1
  Top 0.813: Q3.3 63.36,48.77 R18.1
  Top 1.016: 63.36,48.77 63.36,54.57 61.76,56.17 50.33,56.17 48.73,57.77 48.73,67.91 47.05,69.35 23.58,69.35 21.53,71.41 21.53,71.49 12.15,80.63 12.15,85.51 9.33,88.33 5.54,88.33 J4.4
N$2
  Top 1.016: 70.18,88.63 D1.A
  Top 1.422: X4.2 85.69,89.4 84.54,88.63 70.18,88.63
N$3  (via drill 0.6)
  Top 0.813: R1.2 83.28,22.71 R2.1 81.4,21.33 v80.89,20.81 | v77.76,20.81 76.54,20.81 76.01,20.28 76.01,8.62 75.02,7.63 49.57,7.71 44.61,2.75 11.09,2.91 8.8,4.96 8.8,71.41 7.35,73.16 5.49,73.16 U1.DATA
  Bottom 0.813: v80.89,20.81 v77.76,20.81
N$4
  Top 0.813: R3.1 88.02,17.7 U$1.11
N$5  (via drill 0.6)
  Top 0.813: R3.2 81.41,17.7 R4.2 81.38,15.82 80.28,14.72 v77.53,14.72 | v74.33,14.64 74.41,10.37 72.35,8.93 48.2,8.93 v45.68,6.26
  Bottom 0.813: v77.53,14.72 74.41,14.72 v74.33,14.64 | v45.68,6.26 45.68,3.74 44.61,2.75 11.09,2.91 9.11,4.89 9.11,40.78 6.51,41.69 2.55,42.99 2.55,57.85 3.04,58.34 J2.1
N$6
  Top 0.406: 86.83,21.57 89.36,21.57 U$1.16
  Top 0.813: R1.1 85.68,22.72 86.83,21.57
N$7  (via drill 0.6)
  Top 0.406: U$1.40 89.27,51.98 86.91,51.98
  Top 0.61: 86.91,51.98 86.38,51.98 R7.1
  Top 0.813: v84.92,62.04 R7.1
  Bottom 0.813: SW2.7 31.56,55.84 33.11,57.39 36.31,57.39 37.45,58.53 37.45,61.88 38.75,63.18 83.78,63.18 v84.92,62.04
N$8
  Top 1.016: 70.12,95.03 D2.A
  Top 1.422: X5.2 74.79,92.14 71.89,95.03 70.12,95.03
N$9
  Top 0.813: 25.64,91.76 25.18,91.15 24.8,90.61 23.04,90.61 LM2678.3
  Top 1.27: C6.1 31.95,85.41 33.87,87.34 33.87,91.07 32.5,92.44 26.02,92.44 25.64,91.76
N$10  (via drill 0.6)
  Top 0.813: LM2678.2 25.16,89.37 v27.93,90.99
  Top 1.016: 54.93,88.63 D1.C
  Top 1.27: C3.+ 84.81,81.29 85.15,81.63 | 85.15,81.63 C5.1 | 85.15,81.63 83.01,81.63 79.51,85.13 68.54,85.13 65.04,88.63 D1.C 55.47,88.7 D2.C
  Bottom 1.27: v27.93,90.99 54.86,90.99 D1.C
N$11
  Top 0.61: X1.2 15.34,5.86 U$2.PGND
N$13
  Top 0.813: 24.65,87.95 24.72,88.1 LM2678.1
  Top 1.27: 24.65,87.95 24.93,87.95 24.88,84.67 26.03,83.51 C6.2 29.59,80.87 30.75,79.72 32.48,79.72 L1.P$1 32.78,79.41 35.24,79.41 36.16,80.33 36.16,92.14 33.31,94.98 D3.C
N$14
  Top 0.61: X3.2 15.27,40.26 U$4.PGND
N$15
  Top 0.61: X2.2 15.34,23.21 U$3.PGND
N$16
  Top 1.27: C1.+ 76.19,83.53 44.69,83.53 | L1.P$2 44.69,82.42 44.69,83.53 | 44.69,83.53 D4.A
N$17
  Top 0.813: IC1.15 74.42,50.38 75.93,50.38 77.14,49.17 R14.2 80.36,49.17 81.19,50 81.19,69.43 83.71,71.94 89.95,71.94 C4.+
N$18
  Top 0.61: R11.1 42.38,17.78 U$1.58
  Bottom 0.406: 38.44,19.06 41.19,19.06 U$1.58
  Bottom 0.813: 26.02,17.61 36.99,17.61 38.44,19.06
  Bottom 1.016: SW2.8 34.1,51.22 32.42,49.54 25.87,49.54 24.57,48.24 24.57,19.06 26.02,17.61
N$19  (via drill 0.6)
  Top 0.406: U$1.30 90.61,40.6 89.42,39.41 86.91,39.41
  Top 0.61: 86.91,39.41 86,39.41 R8.1
  Top 0.813: SW2.6 29.02,55.36 30.67,57.54 36.31,57.54 37.22,58.46 37.22,62.11 39.74,64.63 v42.41,64.63 | v82.79,64.55 v82.79,56.7 | v84.7,44.21 84.7,40.71 R8.1
  Bottom 0.813: v42.41,64.63 82.71,64.63 v82.79,64.55 | v82.79,56.7 82.79,46.11 v84.7,44.21
N$21  (via drill 0.6)
  Top 0.406: 86.75,36.81 89.36,36.81 U$1.28
  Top 0.61: R9.1 85.53,38.03 86.75,36.81
  Top 0.813: v77.84,66.15 78.98,66.15 79.97,65.16 v79.97,52.82 | v85,35.52 85,37.89 R9.1
  Bottom 0.813: SW2.5 26.48,56.7 28.99,59.22 35.09,59.22 36.08,60.21 36.08,63.48 38.75,66.15 v77.84,66.15 | v79.97,52.82 79.97,36.36 81.57,34.76 84.24,34.76 v85,35.52
N$22
  Top 1.016: J4.3 9.03,85.74 10.32,84.44 10.32,80.1 22.82,67.6 46.14,67.6 47.13,66.61 47.13,49.62 51.4,44.36 Q2.3 52.77,48.41 R16.1
N$23  (via drill 0.6)
  Top 0.813: Q1.3 52.54,37.43 R12.1
  Top 1.016: J4.2 7.38,83.2 8.42,82.15 8.42,79.41 21.68,66.15 43.62,66.15 45,64.78 45,49.31 v46.67,47.64 | v59.25,35.44 55.07,35.44 Q1.3
  Bottom 1.016: v46.67,47.64 59.63,47.64 61.3,45.96 61.3,37.5 v59.25,35.44
N$25  (via drill 0.6)
  Top 0.813: R16.2 50.47,51.36 | 50.47,51.36 55.28,51.37 | 55.28,51.37 58.7,51.37 60,50.15 R18.2 | R12.2 50.47,38.56 50.94,39.02 53.84,39.02 55.28,40.47 55.28,51.37 | JP1.2 19.09,52.89 20.08,52.05 v36.61,52.05 | v48.65,52.05 49.78,52.05 50.47,51.36
  Bottom 0.406: v36.61,52.05 v48.65,52.05
N$26
  Top 0.406: R19.1 11.77,55.56 12.38,54.95 13.6,54.95 13.68,54.88 LED1.A
N$27  (via drill 0.6)
  Top 0.61: R19.2 11.76,48.79 v12.46,47.48 | v36.69,16.09 36.69,21.65 37.83,22.79 39.78,22.79 U$1.61
  Bottom 0.61: v12.46,47.48 21.6,47.48 22.36,46.8 22.36,17.16 23.36,16.09 v36.69,16.09
P  (via drill 0.6)
  Top 0.813: Q3.2 64.35,41.98 64.35,40.85 63.74,40.24 60.16,40.24 59.09,41.31 R17.1 56.65,42.6 v56.65,49.69
  Bottom 0.813: U$1.88 48.06,55.85 49.87,54.04 53.15,54.04 56.5,50.68 56.5,49.85 v56.65,49.69
PH_SENSOR
  Top 0.61: X1.1 15.34,8.4 U$2.PRB
PWR_BUT  (via drill 0.6)
  Top 0.61: IC1.4 66.55,48.01 65.72,47.18 65.72,39.79 64.35,38.42 56.65,38.42 v55.59,37.35
  Bottom 0.406: 43.55,16.47 41.07,16.47 U$1.55
  Bottom 0.61: v55.59,37.35 50.33,37.35 48.42,35.44 48.42,32.09 46.67,30.26 46.67,22.26 44.84,20.43 44.84,17.08 44.23,16.47 43.55,16.47
RX
  Top 0.813: R13.1 47.97,41.54 | 47.97,41.54 49.19,40.32 53.3,40.32 53.76,40.78 53.76,41.9 Q2.2 | 47.97,41.54 46.37,41.54 45.53,40.7 45.53,36.51 44.54,35.52 42.36,35.52 U$1.72
  Bottom 0.813: U$1.72 42.47,35.53 42.56,35.44
TX
  Top 0.813: Q1.2 52.48,29.2 49.19,29.2 48.13,30.56 R10.1 47.82,30.41 45.68,30.41 43.11,32.99 U$1.70
VCC  (via drill 0.6)
  Top 0.61: R7.2 82.93,40.93 R8.2
  Top 0.813: U$1.50 U$1.49 38.63,7.59 37.38,6.33 37.38,4.89 36,4.13 19.09,4.13 17.11,5.34 17.11,9.2 U$2.VCC 15.34,20.57 17.49,22.72 | 17.49,22.72 17.49,26.15 | 17.49,26.15 17.49,26.24 U$3.VCC 15.34,37.87 17.11,39.63 17.11,43.51 U$4.VCC 13.36,45.35 12.46,45.35 10.17,47.64 v10.17,66.31 10.17,73.62 8.12,75.68 U1.VDD | R6.2 18.4,22.69 17.49,22.72 | R5.2 18.49,26.16 17.49,26.15 | v44.84,33.69 46.82,33.69 | 46.82,33.69 47.81,32.4 R10.2 49.18,32.56 50.18,31.56 50.18,30.72 50.48,30.41 51.49,30.41 Q1.1 | Q3.1 62.24,41.84 61.46,41.84 61,42.3 61,42.38 59.69,43.68 R17.2 v59.09,45.12 | Q2.1 51.72,41.84 50.25,41.84 48.42,43.68 R13.2 48.12,43.84 v48.12,45.5 | 46.82,33.69 v46.82,36.43 | R8.2 82.86,40.55 R9.2 82.71,37.89 82.71,25.31 81.95,24.55 80.12,24.55 79.4,23.82 R2.2 79.4,17.69 R4.1 77.61,17.67 v77.61,17.61 | R11.2 46.86,16.58 v44.84,14.56 | v46.82,19.98 46.82,20.28 44.77,22.34 v44.77,23.48
  Top 1.016: U$4.VCC 15.27,53.37 JP1.1
  Bottom 0.813: U$1.50 43.13,7.59 44.84,9.31 v44.84,14.56 44.92,14.56 46.75,16.39 46.75,19.9 v46.82,19.98 49.19,17.61 v77.61,17.61 | v59.09,45.12 59.09,45.43 58.25,46.26 48.88,46.26 v48.12,45.5 46.82,44.21 v46.82,36.43 | v44.77,23.48 44.77,33.62 v44.84,33.69 | J2.3 5.47,64.65 6.44,65.62 9.49,65.62 v10.17,66.31

### Text on the board
tPlace: AQUARIUS
tNames: On/Off
DrillLegend: LAYER-STACK
DrillLegend_01-16: 01-16
DrillLegend_01-20: 01-20